# Altium schematic sheet MCU_Power.SchDoc
size 420 x 297 mm
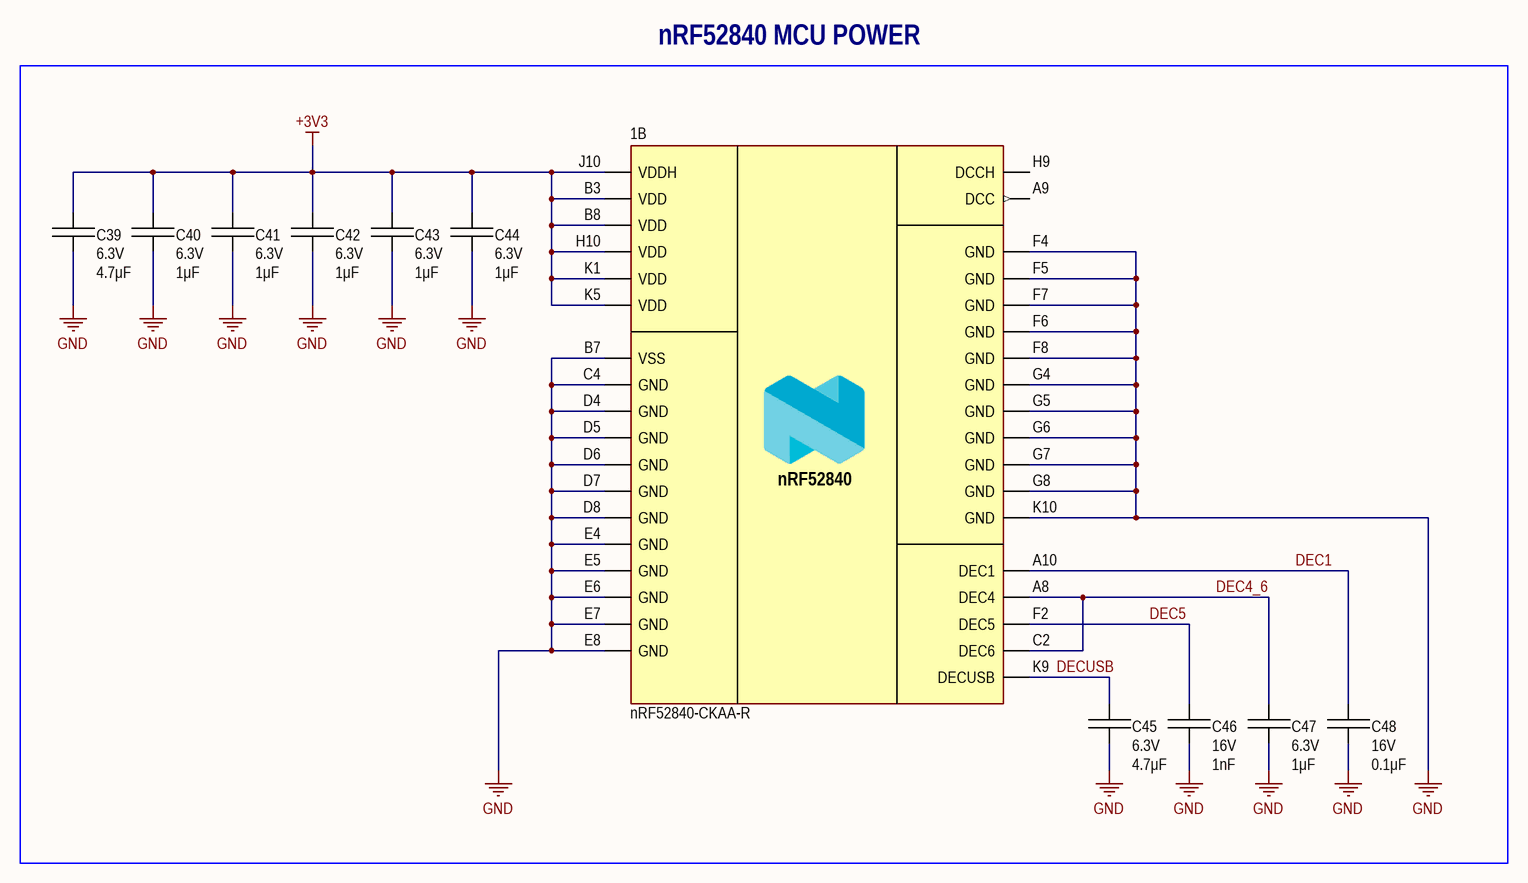
[diagram p0: MCU_Power.SchDoc]

## Parts
1  PartNumber: nRF52840-CKAA-R  [MCU: nRF52840_WLCP93]  (part B of 2)
C39  value 4.7μF  Voltage: 6.3V  [CAP: 0603_NO_SILK]
C40  value 1μF  Voltage: 6.3V  [CAP: 0402_NO_SILK]
C41  value 1μF  Voltage: 6.3V  [CAP: 0402_NO_SILK]
C42  value 1μF  Voltage: 6.3V  [CAP: 0402_NO_SILK]
C43  value 1μF  Voltage: 6.3V  [CAP: 0402_NO_SILK]
C44  value 1μF  Voltage: 6.3V  [CAP: 0402_NO_SILK]
C45  value 4.7μF  Voltage: 6.3V  [CAP: 0603_NO_SILK]
C46  value 1nF  Voltage: 16V  [CAP: 0201]
C47  value 1μF  Voltage: 6.3V  [CAP: 0402_NO_SILK]
C48  value 0.1μF  Voltage: 16V  [CAP: 0402_NO_SILK]

## Blocks framed on the sheet
nRF52840 MCU POWER: 1 C39-C48

## Nets
+3V3: 1.B3(VDD) 1.B8(VDD) 1.H10(VDD) 1.J10(VDDH) 1.K1(VDD) 1.K5(VDD) C39.2 C40.2 C41.2 C42.2 C43.2 C44.2
GND: 1.B7(VSS) 1.C4(GND) 1.D4(GND) 1.D5(GND) 1.D6(GND) 1.D7(GND) 1.D8(GND) 1.E4(GND) 1.E5(GND) 1.E6(GND) 1.E7(GND) 1.E8(GND) 1.F4(GND) 1.F5(GND) 1.F6(GND) 1.F7(GND) 1.F8(GND) 1.G4(GND) 1.G5(GND) 1.G6(GND) 1.G7(GND) 1.G8(GND) 1.K10(GND) C39.1 C40.1 C41.1 C42.1 C43.1 C44.1 C45.1 C46.1 C47.1 C48.1
DEC1: 1.A10(DEC1) C48.2
DEC4_6: 1.A8(DEC4) 1.C2(DEC6) C47.2
DEC5: 1.F2(DEC5) C46.2
DECUSB: 1.K9(DECUSB) C45.2

Not connected (* = marked no-connect by the designer): 1 A9(DCC) H9(DCCH)

## Notes on the sheet
- Author
- Manufacturer
- Date
- Page
- Total pages
- Size page
- A3
- Materials

## Library data of the parts
1 = nRF52840: MCU; Manufacturer: Nordic Semiconductor; CoreSize: 32bit; Speed: 64 MHz; MemoryROM: 1 MB; CoreProcessor: Cortex-M4; MemoryRAM: 256 kB; HelpURL: https://www.mouser.com/ProductDetail/Nordic-Semiconductor/nRF52840-CKAA-R?qs=PqoDHHvF64%2FDLCQsJ11t5w%3D%3D; ComponentType: IC microcontroller; Package: 93-WLCSP; ValueManufacturerPartNumber: =ComponentType+', '+CoreSize+', '+CoreProcessor+', '+Speed+', '+MemoryROM+', '+MemoryRAM+', '+Supply+', '+Temperature+', '+Package
C39 C45 = Ceramic_0603: 4.7 µF ±20% 6.3V Ceramic Capacitor X7R 0603 (1608 Metric); Manufacturer: Yageo; PartNumber: CC0603MRX7R5BB475; ValueManufacturerPartNumber: Ceramic capacitor, 4.7μF, X7R, ±10%, 6.3V, 0603, -55...+125°C; Tolerance: ±10%; Package: 0603; HelpURL: https://www.digikey.com/en/products/detail/yageo/CC0603MRX7R5BB475/7164380; Temperature: -55...+125°C; TypeCapacitor: Ceramic capacitor; TypeDielectric: X7R
C40-C44 C47 = Ceramic_0402: 1 µF ±10% 6.3V Ceramic Capacitor X7R 0402 (1005 Metric); Manufacturer: Yageo; PartNumber: CC0402KRX7R5BB105; ValueManufacturerPartNumber: Ceramic capacitor, 1μF, X7R, ±10%, 6.3V, 0402, -55...+125°C; Package: 0402; HelpURL: https://www.digikey.com/en/products/detail/yageo/CC0402KRX7R5BB105/5195111; Temperature: -55...+125°C; TypeCapacitor: Ceramic capacitor; Tolerance: ±10%; TypeDielectric: X7R
C46 = Ceramic_0201: 1000 pF ±10% 16V Ceramic Capacitor X7R 0201 (0603 Metric); Manufacturer: Yageo; PartNumber: CC0201KRX7R7BB102; ValueManufacturerPartNumber: Ceramic capacitor, 1nF, X7R, ±10%, 16V, 0201, -55...+125°C; Package: 0201; HelpURL: https://www.digikey.com/en/products/detail/yageo/CC0201KRX7R7BB102/2833564; Temperature: -55...+125°C; TypeCapacitor: Ceramic capacitor; Tolerance: ±10%; TypeDielectric: X7R
C48 = Ceramic_0402: 0.1 µF ±10% 16V Ceramic Capacitor X7R 0402 (1005 Metric); Manufacturer: Yageo; PartNumber: CC0402KRX7R7BB104; ValueManufacturerPartNumber: Ceramic capacitor, 0.1μF, X7R, ±10%, 16V, 0402, -55...+125°C; Package: 0402; HelpURL: https://www.digikey.com/product-detail/en/yageo/CC0402KRX7R7BB104/311-1338-1-ND/2103122; Temperature: -55...+125°C; TypeCapacitor: Ceramic capacitor; Tolerance: ±10%; TypeDielectric: X7R